# Altium schematic sheet Sheet2.SchDoc
size 420 x 297 mm; Address1: Address1; Address2: Address2; Address3: Address3; Address4: Address4; DocumentNumber: АБВГ.123456.001 Э3; SheetNumber: 1; SheetTotal: 1; Scale: 1:1; DocumentType: Схема электрическая принципиальная; FirstReferrence: АБВГ.123456.001
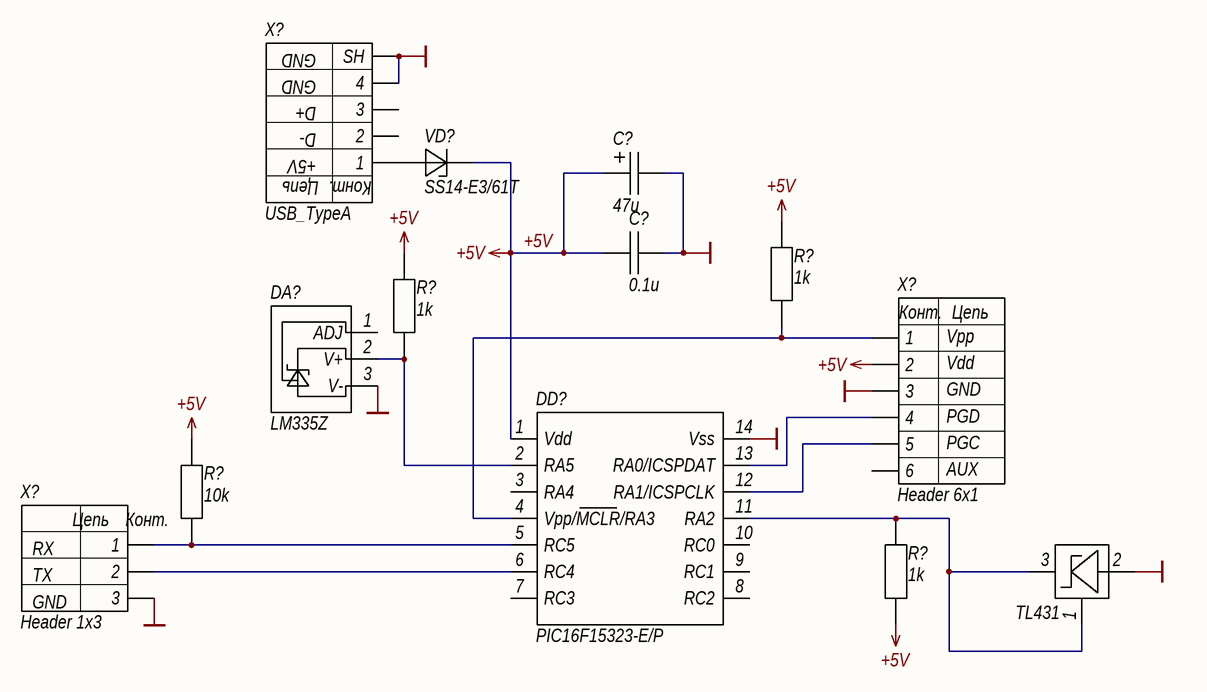
[diagram p0: Sheet2.SchDoc]

## Parts
(Parts that share a designator on the sheet are numbered #1, #2 ... from top to bottom, then left to right.)
C?#1  47u  [Capacitor_pol]
C?#2  0.1u  [0603_CAP]
DA?#1  LM335Z
DA?#2  TL431
DD?  PIC16F15323-E/P
R?#1  1k  [0603_RES]
R?#2  1k  [0603_RES]
R?#3  1k  [0603_RES]
R?#4  10k  [0603_RES]
VD?  SS14-E3/61T  [DO-214AC]
X?#1  USB_TypeA
X?#2  Header 6x1  [PBS-06]
X?#3  Header 1x3  [HDR2X3]

## Nets
+5V: C?#1.1 C?#2.1 DD?.1(Vdd) R?#1.2 R?#2.2 R?#3.2 R?#4.2 VD?.K X?#2.2
GND: C?#1.2 C?#2.2 DA?#1.3(V-) DD?.14(Vss) X?#1.0(SH) X?#1.4 X?#2.3 X?#3.3
NetDA?#1_2: DA?#1.2(V+) DD?.2(RA5) R?#2.1
NetDA?#2_1: DA?#2.1 DD?.11(RA2) R?#3.1
NetDD?_4: DD?.4(Vpp/MCLR/RA3) R?#1.1 X?#2.1
NetDD?_5: DD?.5(RC5) R?#4.1 X?#3.1
NetDD?_6: DD?.6(RC4) X?#3.2
NetDD?_12: DD?.12(RA1/ICSPCLK) X?#2.5
NetDD?_13: DD?.13(RA0/ICSPDAT) X?#2.4
NetVD?_A: VD?.A X?#1.1

Not connected (* = marked no-connect by the designer): DA?#1 1(ADJ); DA?#2 2 3; DD? 3(RA4) 7(RC3) 8(RC2) 9(RC1) 10(RC0); X?#1 2 3; X?#2 6

## Notes on the sheet
- (near X?#2) Vpp
- (near X?#2) Vdd
- (near X?#2) GND
- (near X?#2) PGD
- (near X?#2) PGC
- (near X?#2) AUX
- RX
- TX
- GND
- Labels drawn without touching a wire or pin: GND
- Перв. примен.
- Справ. №
- Подп. и дата
- Инв. № дубл.
- Взам. инв. №
- Разраб.
- Изм.
- Лист
- № докум.
- Подп.
- Дата
- Лит.
- Масса
- Масштаб
- Пров.
- Т.контр.
- Листов
- Инв. № подл.
- Утв.
- Н.контр.
- 2.106-A3
- Копировал
- Формат А3
- (in symbol Header 1x3) Цепь; Конт.
- (in symbol Header 6x1) Конт.; Цепь
- (in symbol USB_TypeA) GND; D+; D-; +5V; Цепь; Конт.

## Library data of the parts
C?#1 = Capacitor_pol: ValueType: Конденсатор; Value: 47u; Tolerance: *; Dielectric: *; Voltage: *; ESR: *; URL: *; Temp: *; Power: *; Case: *; ValueManufacturer: *; ValueManufacturerPartNumber: *; ValueDescription: *
C?#2 = Capacitor: ValueType: Конденсатор; Value: 0.1u; Tolerance: *; Dielectric: *; Voltage: *; ESR: *; URL: *; Temp: *; Power: *; Case: *; ValueManufacturer: *; ValueManufacturerPartNumber: *; ValueDescription: *
R?#1-R?#4 = Resistor: ValueType: Резистор; Value: *; Tolerance: *; URL: *; Temp: *; Power: *; Case: *; ValueManufacturer: *; ValueManufacturerPartNumber: *; ValueDescription: *
VD? = DiodeSch_SS14_E3/61T: ValueManufacturer: Vishay; ValueType: Диод Шоттки; Value: *; URL: *; Temp: *; Case: *; ValueManufacturerPartNumber: SS14-E3/61T; ValueDescription: Диод Шоттки
X?#1 = USB_TypeA: ValueManufacturer: Te Connectivity; ValueManufacturerPartNumber: 292304-1; ValueType: USB разъем тип B
X?#2 = Header 6x1: ValueType: Разъем; Case: PBS-6; Temp: *; URL: *; ValueManufacturer: *; ValueManufacturerPartNumber: *
X?#3 = Header 1x3: ValueDescription: PLD-3; ValueType: Разъем штыревой 2,54 мм; Case: HDR1X3; Temp: *; URL: *; Value: *; ValueManufacturer: *; ValueManufacturerPartNumber: *